# Altium schematic sheet PowerRegulator.SchDoc
size A4
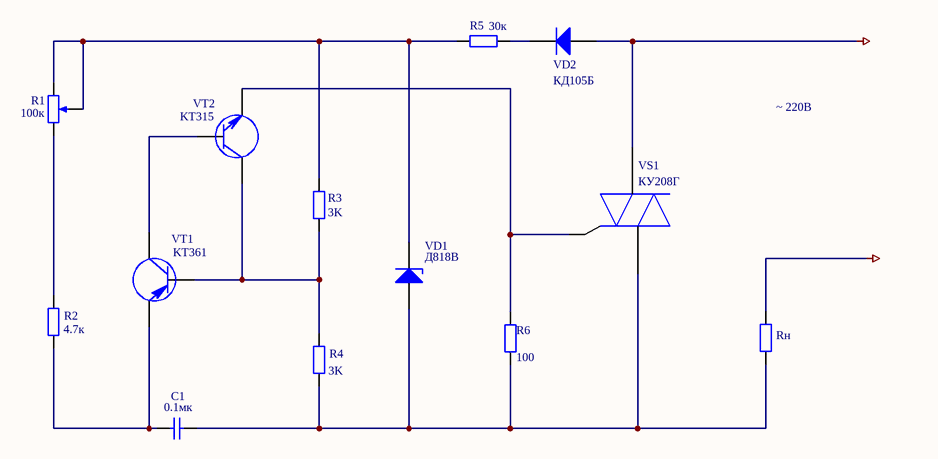
[diagram p0: PowerRegulator.SchDoc]

## Parts
C1  value 0.1мк  [RAD-0.3]  (hidden comment: Cap)
R1  value 100к  [VR5]  (hidden comment: RPot)
R2  value 4.7к  [AXIAL-0.4]  (hidden comment: Res2)
R3  value 3K  [AXIAL-0.4]  (hidden comment: Res2)
R4  value 3K  [AXIAL-0.4]  (hidden comment: Res2)
R5  value 30к  [AXIAL-0.4]  (hidden comment: Res2)
R6  value 100  [AXIAL-0.4]  (hidden comment: Res2)
Rн  Res2  [AXIAL-0.4]  (value not drawn)
VD1  Д818В  [DIODE-0.7]
VD2  КД105Б  [SMC]
VS1  КУ208Г
VT1  KT361  [SOT-23B_N]
VT2  KT315  [TO-226-AA]

## Nets
GND: Rн.2 VD2.1(A) VS1.1
NetC1_1: C1.1 R2.1 VT1.1(C)
NetC1_2: C1.2 R4.1 R6.1 Rн.1 VD1.1(A) VS1.2
NetR1_1: R1.1(TOP) R2.2
NetR1_2: R1.2(BOT) R1.3(TAP) R3.2 R5.2 VD1.2(K)
NetR3_1: R3.1 R4.2 VT1.2(B) VT2.3(E)
NetR5_1: R5.1 VD2.2(K)
NetR6_2: R6.2 VS1.3 VT2.1(C)
NetVT1_3: VT1.3(E) VT2.2(B)

## Notes on the sheet
- ~ 220В

## Library data of the parts
C1 = Cap: Capacitor; Published: 8-Jun-2000; LatestRevisionDate: 17-Jul-2002; LatestRevisionNote: Re-released for DXP Platform.; PackageReference: RAD-0.3; Publisher: Altium Limited; PackageDescription: Radial Cap, Thru-Hole; 2 Leads; 0.3 in Pin Spacing
R1 = RPot: Potentiometer; Sim Note: Enter the Resistance value and the set point into parameter fields.; Set Position: 0.5; Published: 8-Jun-2000; LatestRevisionDate: 17-Jul-2002; LatestRevisionNote: Re-released for DXP Platform.; PackageReference: VR5; Publisher: Altium Limited; PackageDescription: Variable Resistor, Thru-Hole; 3 Leads
R2-R6 = Res2: Resistor; Published: 8-Jun-2000; LatestRevisionDate: 17-Jul-2002; LatestRevisionNote: Re-released for DXP Platform.; PackageReference: AXIAL-0.4; Publisher: Altium Limited; PackageDescription: Axial Device, Thru-Hole; 2 Leads; 0.4 in Pin Spacing
Rн = Res2: Resistor; Value: 0; Published: 8-Jun-2000; LatestRevisionDate: 17-Jul-2002; LatestRevisionNote: Re-released for DXP Platform.; PackageReference: AXIAL-0.4; Publisher: Altium Limited; PackageDescription: Axial Device, Thru-Hole; 2 Leads; 0.4 in Pin Spacing
VD1 = D Zener: Zener Diode; Published: 8-Jun-2000; LatestRevisionDate: 17-Jul-2002; LatestRevisionNote: Re-released for DXP Platform.; PackageReference: DIODE-0.7; Publisher: Altium Limited; PackageDescription: Diode, Thru-Hole; 2 Leads; 0.7 in Pin Spacing
VD2 = Diode: Default Diode; Published: 8-Jun-2000; LatestRevisionDate: 17-Jul-2002; LatestRevisionNote: Re-released for DXP Platform.; PackageVersion: Sep-1996; PackageReference: SMC; Publisher: Altium Limited; PackageDescription: DO-214-AB/SMC; 2 C-Bend Leads; Body 7.9 x 5.9 mm, inc. leads (LxW); Code_JEDEC: DO-214-AB
VS1 = Thyristor: Generic thyristor
VT1 = PNP: PNP Bipolar Transistor; Published: 8-Jun-2000; LatestRevisionDate: 29-May-2009; LatestRevisionNote: IPC-7351 Footprint Added.; PackageVersion: Aug-1999; PackageReference: SOT-23B; Publisher: Altium Limited; PackageDescription: 3-Pin SOT-23 Package 0.95 mm Pitch, 2.4 mm Lead Span
VT2 = NPN: NPN Bipolar Transistor; Published: 8-Jun-2000; LatestRevisionDate: 17-Jul-2002; LatestRevisionNote: Re-released for DXP Platform.; PackageReference: TO-226-AA; Publisher: Altium Limited; PackageDescription: TO, Flat Index; 3 In-Line, Axial Leads; Body Dia. 4.8mm; Leads 0.55 x 0.51 mm (max); Code_JEDEC: TO-226-AA